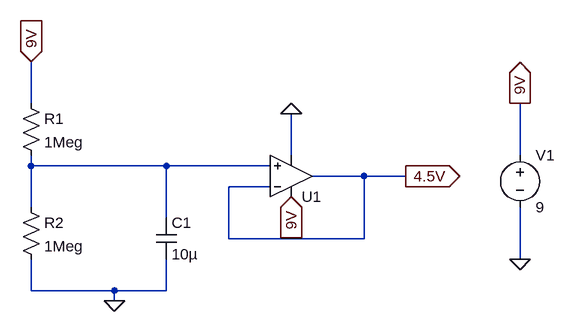
[diagram p0: schematic PSupply_Draft.asc]
PSupply_Draft.asc, the LTspice schematic file:
Version 4.1
SHEET 1 880 680
WIRE -64 80 -64 16
WIRE 336 160 336 96
WIRE 688 160 688 80
WIRE -64 176 -64 160
WIRE 144 176 -64 176
WIRE 304 176 144 176
WIRE 448 192 368 192
WIRE 512 192 448 192
WIRE 304 208 240 208
WIRE -64 240 -64 176
WIRE 144 256 144 176
WIRE 240 288 240 208
WIRE 448 288 448 192
WIRE 448 288 240 288
WIRE 688 320 688 240
WIRE -64 368 -64 320
WIRE 64 368 -64 368
WIRE 144 368 144 320
WIRE 144 368 64 368
WIRE 64 384 64 368
FLAG 64 384 0
FLAG 688 80 9V
IOPIN 688 80 Out
FLAG 688 320 0
FLAG 336 96 0
FLAG -64 16 9V
IOPIN -64 16 In
FLAG 336 224 9V
IOPIN 336 224 In
FLAG 512 192 4.5V
IOPIN 512 192 Out
SYMBOL res -80 64 R0
SYMATTR InstName R1
SYMATTR Value 1Meg
SYMBOL res -80 224 R0
SYMATTR InstName R2
SYMATTR Value 1Meg
SYMBOL cap 128 256 R0
SYMATTR InstName C1
SYMATTR Value 10µ
SYMBOL voltage 688 144 R0
WINDOW 123 0 0 Left 0
WINDOW 39 0 0 Left 0
SYMATTR InstName V1
SYMATTR Value 9
SYMBOL OpAmps\\UniversalOpAmp 336 192 M180
SYMATTR InstName U1

The netlist it stands for:
* PSupply_Draft.asc
R1 9V N001 1Meg
R2 N001 0 1Meg
C1 N001 0 10µ
V1 9V 0 9
X§U1 N001 4.5V 9V 0 4.5V level1 Avol=1Meg GBW=10Meg Vos=0 En=0 Enk=0 In=0 Ink=0 Rin=500Meg  ; pins In+ In- V+ V- OUT
.lib UniversalOpAmp1.lib
.backanno
.end